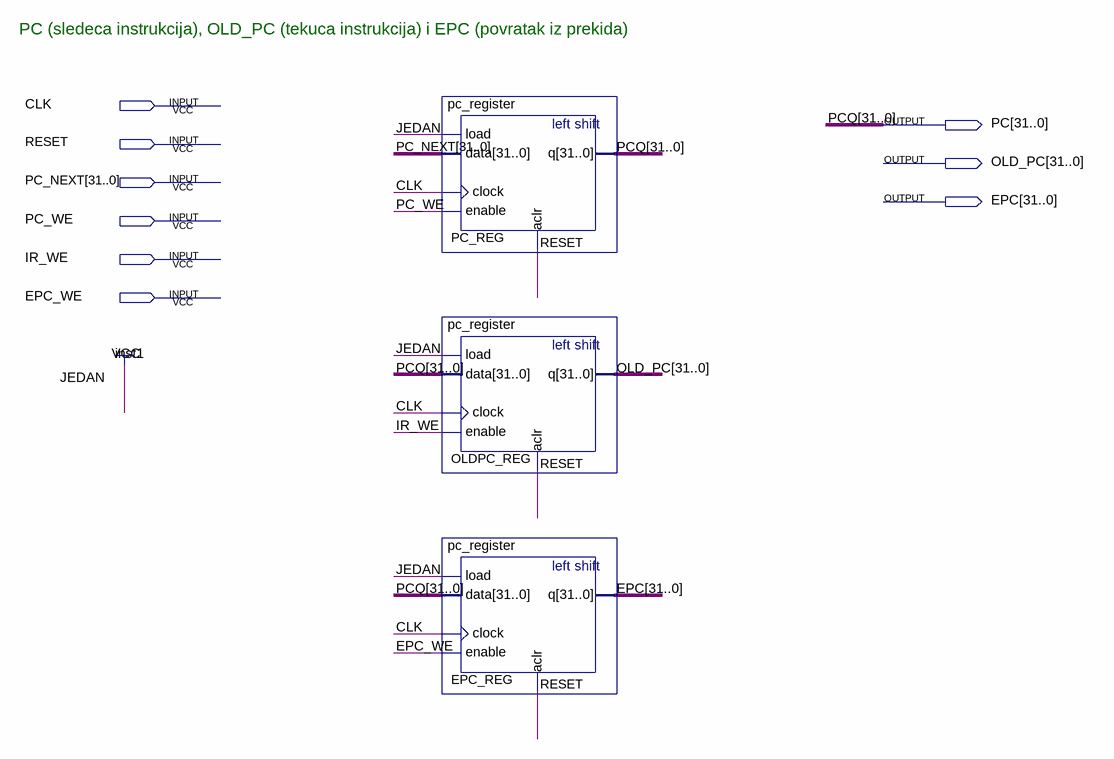
[diagram p0: schematic sheet]
// Quartus schematic pc.bdf as structural Verilog: 3 symbols, 9 pins
module pc (
  input  CLK,
  input  RESET,
  input  [31:0] PC_NEXT,
  input  PC_WE,
  input  IR_WE,
  input  EPC_WE,
  output [31:0] PC,
  output [31:0] OLD_PC,
  output [31:0] EPC
);

  pc_register PC_REG (.load(1'b1), .data(PC_NEXT), .clock(CLK), .enable(PC_WE), .aclr(RESET), .q(PC));
  pc_register OLDPC_REG (.load(1'b1), .data(PC), .clock(CLK), .enable(IR_WE), .aclr(RESET), .q(OLD_PC));
  pc_register EPC_REG (.load(1'b1), .data(PC), .clock(CLK), .enable(EPC_WE), .aclr(RESET), .q(EPC));

  // Other names for the same wires on the sheet: PCQ[31:0] = PC

  // Notes on the sheet:
  //   PC (sledeca instrukcija), OLD_PC (tekuca instrukcija) i EPC (povratak iz prekida)
endmodule
